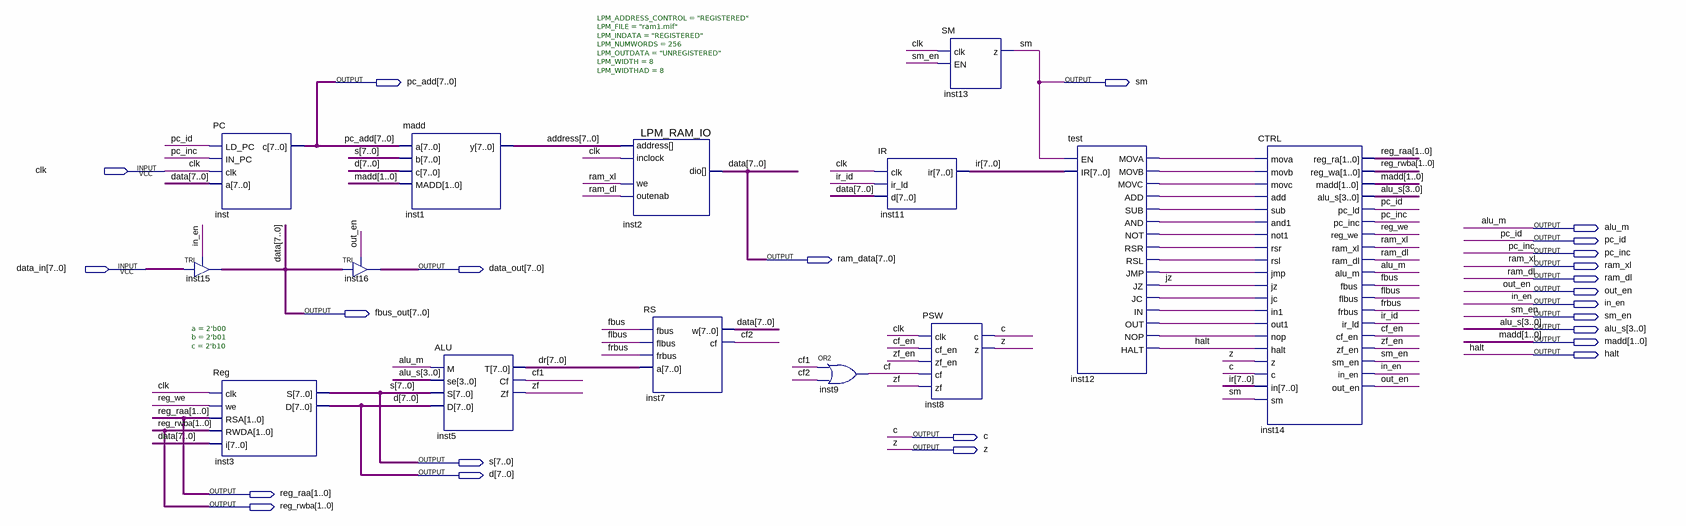
[diagram p0: schematic sheet]
// Quartus schematic CPU.bdf as structural Verilog: 14 symbols, 24 pins
module CPU (
  input  clk,
  input  [7:0] data_in,
  output [7:0] pc_add,
  output sm,
  output alu_m,
  output pc_id,
  output pc_inc,
  output [7:0] ram_data,
  output ram_xl,
  output [7:0] data_out,
  output ram_dl,
  output out_en,
  output in_en,
  output [7:0] fbus_out,
  output sm_en,
  output [3:0] alu_s,
  output [1:0] madd,
  output halt,
  output c,
  output z,
  output [7:0] s,
  output [7:0] d,
  output [1:0] reg_raa,
  output [1:0] reg_rwba
);

  wire cf, cf1, cf2, cf_en, fbus, flbus, frbus, inst12_add, inst12_and, inst12_in, inst12_jc, inst12_jmp,
       inst12_mova, inst12_movb, inst12_movc, inst12_nop, inst12_not, inst12_out, inst12_rsl, inst12_rsr,
       inst12_sub, ir_id, jz, reg_we, zf, zf_en;
  wire [7:0] address, dr, ir;

  TRI inst15[7:0] (.IN(data_in), .OE(in_en), .OUT(fbus_out));
  PC inst (.LD_PC(pc_id), .IN_PC(pc_inc), .clk(clk), .a(fbus_out), .c(pc_add));
  Reg #(.a(2'b00), .b(2'b01), .c(2'b10)) inst3 (
    .clk(clk), .we(reg_we), .RSA(reg_raa), .RWDA(reg_rwba), .i(fbus_out), .S(s), .D(d));
  TRI inst16[7:0] (.IN(fbus_out), .OE(out_en), .OUT(data_out));
  madd inst1 (.a(pc_add), .b(s), .c(d), .MADD(madd), .y(address));
  ALU inst5 (.M(alu_m), .se(alu_s), .S(s), .D(d), .T(dr), .Cf(cf1), .Zf(zf));
  LPM_RAM_IO #(.LPM_ADDRESS_CONTROL("REGISTERED"), .LPM_FILE("ram1.mif"), .LPM_INDATA("REGISTERED"), .LPM_NUMWORDS(256), .LPM_OUTDATA("UNREGISTERED"), .LPM_WIDTH(8), .LPM_WIDTHAD(8)) inst2 (
    .address(address), .inclock(clk), .we(ram_xl), .outenab(ram_dl), .dio(fbus_out));
  RS inst7 (.fbus(fbus), .flbus(flbus), .frbus(frbus), .a(dr), .w(fbus_out), .cf(cf2));
  or inst9 (cf, cf1, cf2);
  IR inst11 (.clk(clk), .ir_ld(ir_id), .d(fbus_out), .ir(ir));
  SM inst13 (.clk(clk), .EN(sm_en), .z(sm));
  PSW inst8 (.clk(clk), .cf_en(cf_en), .zf_en(zf_en), .cf(cf), .zf(zf), .c(c), .z(z));
  test inst12 (
    .EN(sm), .IR(ir), .MOVA(inst12_mova), .MOVB(inst12_movb), .MOVC(inst12_movc), .ADD(inst12_add),
    .SUB(inst12_sub), .AND(inst12_and), .NOT(inst12_not), .RSR(inst12_rsr), .RSL(inst12_rsl),
    .JMP(inst12_jmp), .JZ(jz), .JC(inst12_jc), .IN(inst12_in), .OUT(inst12_out), .NOP(inst12_nop), .HALT(halt));
  CTRL inst14 (
    .mova(inst12_mova), .movb(inst12_movb), .movc(inst12_movc), .add(inst12_add), .sub(inst12_sub),
    .and1(inst12_and), .not1(inst12_not), .rsr(inst12_rsr), .rsl(inst12_rsl), .jmp(inst12_jmp), .jz(jz),
    .jc(inst12_jc), .in1(inst12_in), .out1(inst12_out), .nop(inst12_nop), .halt(halt), .z(z), .c(c), .in(ir),
    .sm(sm), .reg_ra(reg_raa), .reg_wa(reg_rwba), .madd(madd), .alu_s(alu_s), .pc_ld(pc_id), .pc_inc(pc_inc),
    .reg_we(reg_we), .ram_xl(ram_xl), .ram_dl(ram_dl), .alu_m(alu_m), .fbus(fbus), .flbus(flbus),
    .frbus(frbus), .ir_ld(ir_id), .cf_en(cf_en), .zf_en(zf_en), .sm_en(sm_en), .in_en(in_en), .out_en(out_en));

  assign ram_data = fbus_out;

  // Other names for the same wires on the sheet: data[7:0] = fbus_out
endmodule
